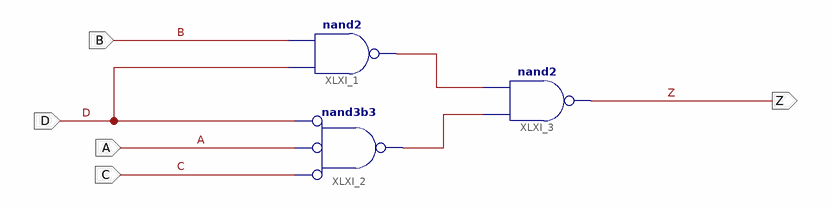
[diagram p0: schematic sheet 1]
// Xilinx ISE schematic p1ej1b.sch (spartan3) as structural Verilog: 3 symbols, 5 ports
module p1ej1b (
  input  D,
  input  A,
  input  C,
  input  B,
  output Z
);

  wire XLXN_1, XLXN_2;

  nand XLXI_1 (XLXN_1, D, B);
  nand XLXI_2 (XLXN_2, ~C, ~A, ~D);  // nand3b3
  nand XLXI_3 (Z, XLXN_2, XLXN_1);
endmodule
